# EAGLE design DebuggerConnector (EAGLE 6.1)
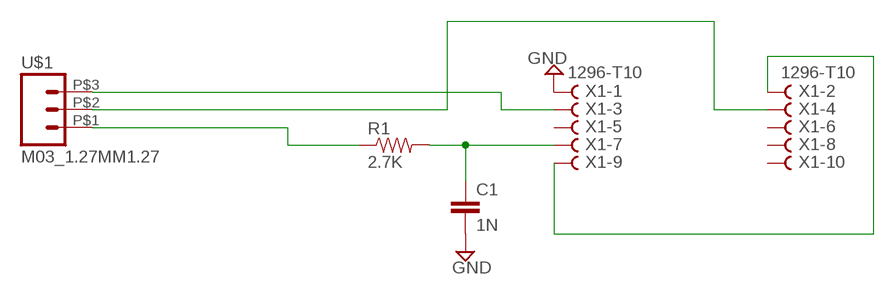
[diagram p0: schematic, sheet 1]

## Parts
C1  1N  CAP0402-CAP  [0402-CAP]
R1  2.7K  RESISTOR0402-RES  [0402-RES]
U$1  M03_1.27MM1.27  [1X3_1.27MM]
X1  1296-T10  [1296-10]

## Nets
GND: C1.2 X1.1
N$1: U$1.P$3 X1.3
N$2: U$1.P$2 X1.4
N$3: R1.1 U$1.P$1
N$4: C1.1 R1.2 X1.7
N$5: X1.2 X1.9
Unconnected: X1.5 X1.6 X1.8 X1.10

## Library data of the parts
C1 = SparkFun-Capacitors:CAP: Capacitor Standard 0603 ceramic capacitor, and 0.1" leaded capacitor.
R1 = SparkFun-Resistors:RESISTOR: Resistor Basic schematic elements and footprints for 0603, 1206, and PTH resistors.
U$1 = SparkFun-Connectors:M03_1.27MM
X1 = con-leotronics:1296-T10: 1.27mm SINGLE ROW FEMALE SOCKET Source: http://www.leotronics.co.uk/Conexcon/Data%20Sheets/sec.%20A/1296ing.pdf; OC_FARNELL: unknown; OC_NEWARK: unknown

## Board
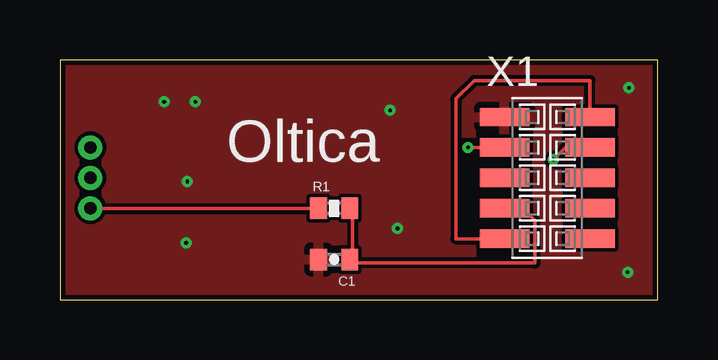
[diagram p1: board, top side]
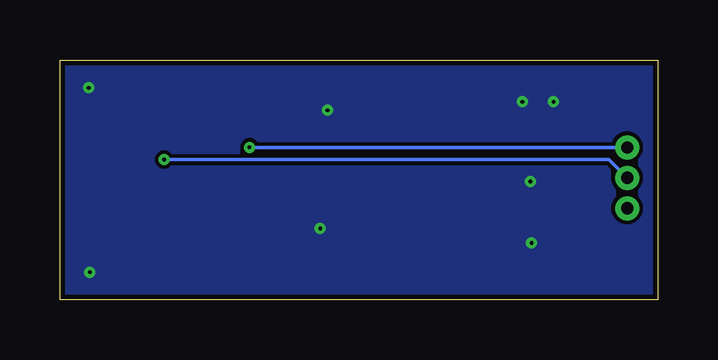
[diagram p2: board, bottom side, seen from below]

Size 24.92 x 10 mm. Coordinates in mm from the lower left corner, seen from the top.
Outline: 0,0 24.92,0 24.92,10 0,10 0,0
Copper layers (1*16): Top 0.035mm / dielectric 1.5mm / Bottom 0.035mm
Design rules: minimum track width 6mil, minimum drill 6mil, track to track 6mil, track to pad 6mil, pad to pad 6mil, via to via 6mil, smd to smd 6mil, copper to edge 8mil, drill to drill 6mil, minimum pad ring 6mil, minimum via ring 6mil, stop-mask expansion 4mil, vias tented up to drill 0mil, thermal gap 10mil

### Footprints (pad centres in the part's own frame; a part is rotated, then mirrored left to right if it is on the bottom)
0402-CAP = smd 0.7 x 0.9: 1 -0.65,0; 2 0.65,0
0402-RES = smd 0.7 x 0.9: 1 -0.65,0; 2 0.65,0
1X3_1.27MM = drill 0.508 pad 1: P$1 -1.27,0; P$2 0,0; P$3 1.27,0
1296-10 = smd 0.76 x 2.05: 1 -2.54,-1.78; 2 -2.54,1.78; 3 -1.27,-1.78; 4 -1.27,1.78; 5 0,-1.78; 6 0,1.78; 7 1.27,-1.78; 8 1.27,1.78; 9 2.54,-1.78; 10 2.54,1.78

### Placement (x,y rotation side)
C1  11.43,1.67 180 top
R1  11.43,3.81 0 top
U$1  1.27,5.08 90 top
X1  20.32,5.08 270 top

### Tracks (layer width: path | path; a pad name or v marks a point on that pad's centre or on a via)
GND  (via drill 0.15)
  other vias: 4.34,8.26 5.64,8.26 5.31,4.93 5.26,2.36 14.07,2.97 13.77,7.9 23.72,8.84 23.67,1.14
  pour Top: 0,10 24.9,10 24.9,0 0,0
  pour Bottom: 0,10 24.9,10 24.9,0 0,0
N$1  (via drill 0.15)
  Top 0.152: v17.02,6.35 18.29,6.35 X1.3
  Bottom 0.152: v17.02,6.35 U$1.P$3
N$2  (via drill 0.15)
  Top 0.152: v20.57,5.84 21.08,6.35 X1.4
  Bottom 0.152: U$1.P$2 2.03,5.84 v20.57,5.84
N$3
  Top 0.152: U$1.P$1 10.67,3.81 R1.1
N$4
  Top 0.152: R1.2 12.19,3.81 12.19,1.78 C1.1 12.19,1.52 19.81,1.52 19.81,3.3 19.3,3.81 X1.7
N$5
  Top 0.152: X1.9 18.29,2.54 16.51,2.54 16.51,8.38 17.27,9.14 22.1,9.14 X1.2

### Text on the board
tPlace: Oltica